# EAGLE design led (EAGLE 7.5.0)
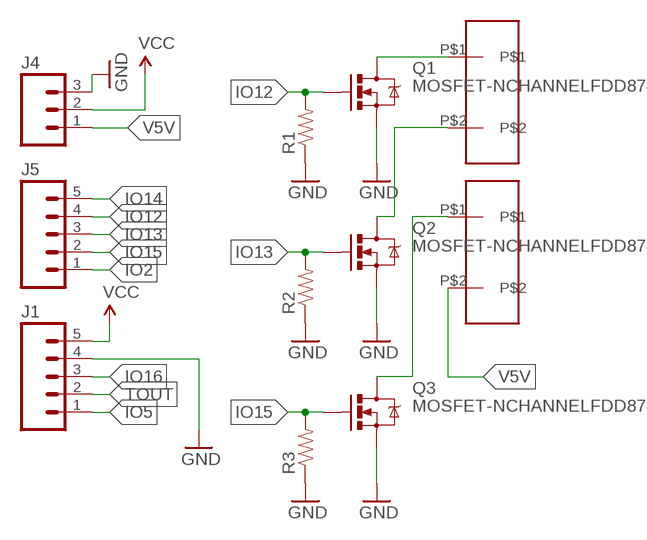
[diagram p0: schematic, sheet 1]

## Parts
J1  M05PTH  [1X05]
J4  M03PTH  [1X03]
J5  M05PTH  [1X05]
Q1  MOSFET-NCHANNELFDD8780  [DPAK]
Q2  MOSFET-NCHANNELFDD8780  [DPAK]
Q3  MOSFET-NCHANNELFDD8780  [DPAK]
R1  RESISTOR0805-RES  [0805]
R2  RESISTOR0805-RES  [0805]
R3  RESISTOR0805-RES  [0805]
U$1  SCREWTERMINALS_5MM_2  [TERMINAL_2X]
U$2  SCREWTERMINALS_5MM_2  [TERMINAL_2X]

## Nets
GND: J1.4 J4.3 Q1.3(S) Q2.3(S) Q3.3(S) R1.1 R2.1 R3.1
IO2: J5.1
IO5: J1.1
IO12: J5.4 Q1.1(G) R1.2
IO13: J5.3 Q2.1(G) R2.2
IO14: J5.5
IO15: J5.2 Q3.1(G) R3.2
IO16: J1.3
N$1: Q1.4(D) U$1.P$1
N$2: Q2.4(D) U$1.P$2
N$3: Q3.4(D) U$2.P$1
TOUT: J1.2
V5V: J4.1 U$2.P$2
VCC: J1.5 J4.2

## Library data of the parts
J1 J5 = SparkFun-Connectors:M05: Header 5 Standard 5-pin 0.1" header. Use with straight break away headers (SKU : PRT-00116), right angle break away headers (PRT-00553), swiss pins (PRT-00743), machine pins (PRT-00117), and female headers (PRT-00115). Molex polarized connector foot print use with SKU : PRT-08230 with associated crimp pins and housings.
J4 = SparkFun-Connectors:M03: Header 3 Standard 3-pin 0.1" header. Use with straight break away headers (SKU : PRT-00116), right angle break away headers (PRT-00553), swiss pins (PRT-00743), machine pins (PRT-00117), and female headers (PRT-00115). Molex polarized connector foot print use with SKU : PRT-08232 with associated crimp pins and housings.
Q1-Q3 = SparkFun-DiscreteSemi:MOSFET-NCHANNEL: Common NMOSFET Parts MFG P/N Store ID Prod ID FDD8780 TRANS-09984 SI7820DN TRANS-11055 FDS6630A IC-08089 2N7002PW TRANS-11151 FQP30N06L COM-10213 TRANS-10060 BSS123LT1G TRANS-08345 BSS138 TRANS-00830 BS170 2N7000; PROD_ID: TRANS-09984
R1-R3 = SparkFun-Resistors:RESISTOR: Resistor Basic schematic elements and footprints for 0603, 1206, and PTH resistors.
U$1 U$2 = captain-slow:SCREWTERMINALS_5MM_2

## Board
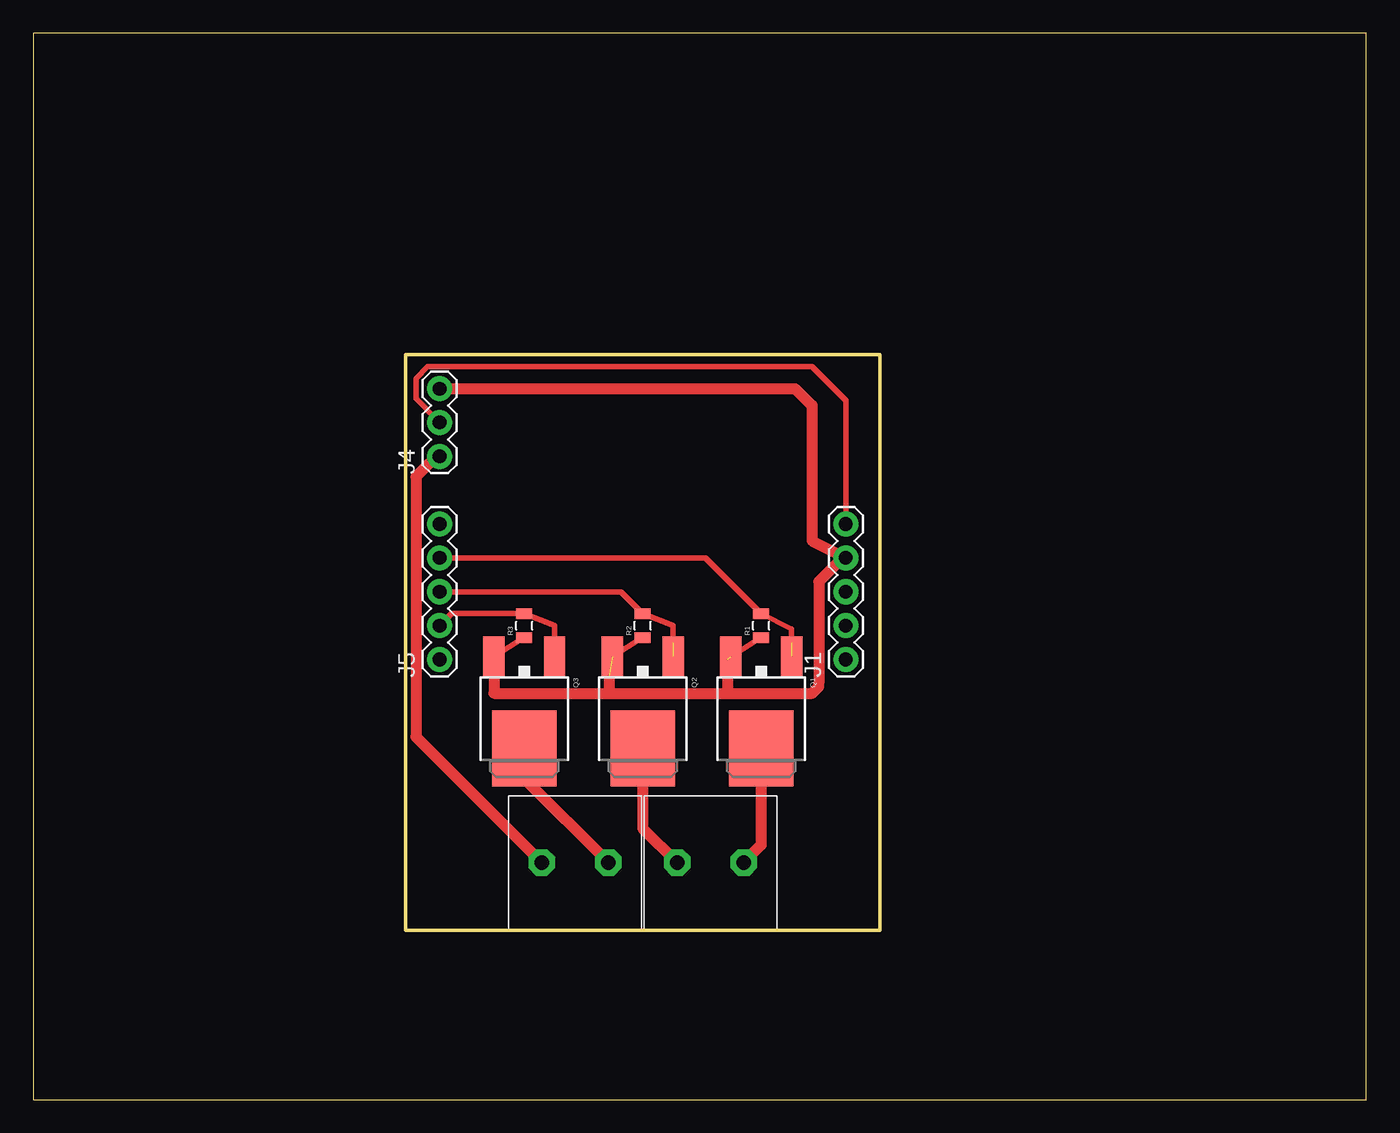
[diagram p1: board, top side]

Size 100 x 80 mm. Coordinates in mm from the lower left corner, seen from the top.
Outline: 0,0 100,0 100,80 0,80 0,0
Outline: 27.94,12.7 63.5,12.7 63.5,55.88 27.94,55.88 27.94,12.7
Copper layers (1*16): Top 0.035mm / dielectric 1.5mm / Bottom 0.035mm
Design rules "default": minimum track width 10mil, minimum drill 24mil, track to track 8mil, track to pad 8mil, pad to pad 8mil, via to via 8mil, smd to smd 8mil, copper to edge 40mil, drill to drill 8mil, minimum pad ring 10mil, minimum via ring 8mil, stop-mask expansion 4mil, vias tented up to drill 0mil, thermal gap 10mil

### Footprints (pad centres in the part's own frame; a part is rotated, then mirrored left to right if it is on the bottom)
1X05 = drill 1.016 pad 1.88: 1 0,0; 2 2.54,0; 3 5.08,0; 4 7.62,0; 5 10.16,0
1X03 = drill 1.016 pad 1.88: 1 0,0; 2 2.54,0; 3 5.08,0
DPAK = smd 1.6 x 3: 1 -2.28,-5.31; 3 2.28,-5.31 | smd 4.826 x 5.715: 4 0,1.588
0805 = smd 0.8 x 1.2: 1 -0.9,0; 2 0.9,0
TERMINAL_2X = drill 1.1 pad 2 octagon: P$1 0,2.5; P$2 0,-2.5

### Placement (x,y rotation side)
J1  60.96,33.02 90 top
J4  30.48,48.26 90 top
J5  30.48,33.02 90 top
Q1  54.61,27.94 180 top
Q2  45.72,27.94 180 top
Q3  36.83,27.94 180 top
R1  54.61,35.56 90 top
R2  45.72,35.56 90 top
R3  36.83,35.56 90 top
U$1  50.8,17.78 270 top
U$2  40.64,17.78 270 top

### Tracks (layer width: path | path; a pad name or v marks a point on that pad's centre or on a via)
GND  (2 unrouted)
  Top 0.254: 60.81,40.46 J1.4
  Top 0.406: R3.1 Q3.3 | R2.1 Q2.3 | R1.1 52.83,33.53 Q1.3 | J1.4 60.71,40.64 | 58.93,31.24 58.93,30.99
  Top 0.813: Q3.3 34.55,30.48 43.18,30.48 | 43.18,31.75 43.18,30.48 | 43.18,30.48 52.07,30.48 | 52.07,33.02 52.07,30.48 | 52.07,30.48 58.42,30.48 58.93,30.99 | J4.3 57.15,53.34 58.42,52.07 58.42,41.91 J1.4 | 60.71,40.64 58.93,38.86 58.93,31.24
IO12  (1 unrouted)
  Top 0.406: 56.9,34.29 56.9,35.31 R1.2 50.43,40.64 J5.4
IO13  (1 unrouted)
  Top 0.406: 48.01,34.29 48.01,35.56 R2.2 44.08,38.1 J5.3
IO15
  Top 0.406: Q3.1 39.12,35.56 R3.2 31.38,36.46 J5.2
N$1
  Top 0.813: Q1.4 54.61,19.09 U$1.P$1
N$2
  Top 0.813: Q2.4 45.72,20.36 U$1.P$2
N$3
  Top 0.813: Q3.4 36.83,24.09 U$2.P$1
V5V
  Top 0.813: J4.1 30.23,48.26 28.7,46.74 28.7,27.22 U$2.P$2
VCC
  Top 0.406: J4.2 28.7,52.58 28.7,54.1 29.59,54.99 58.42,54.99 60.96,52.45 J1.5